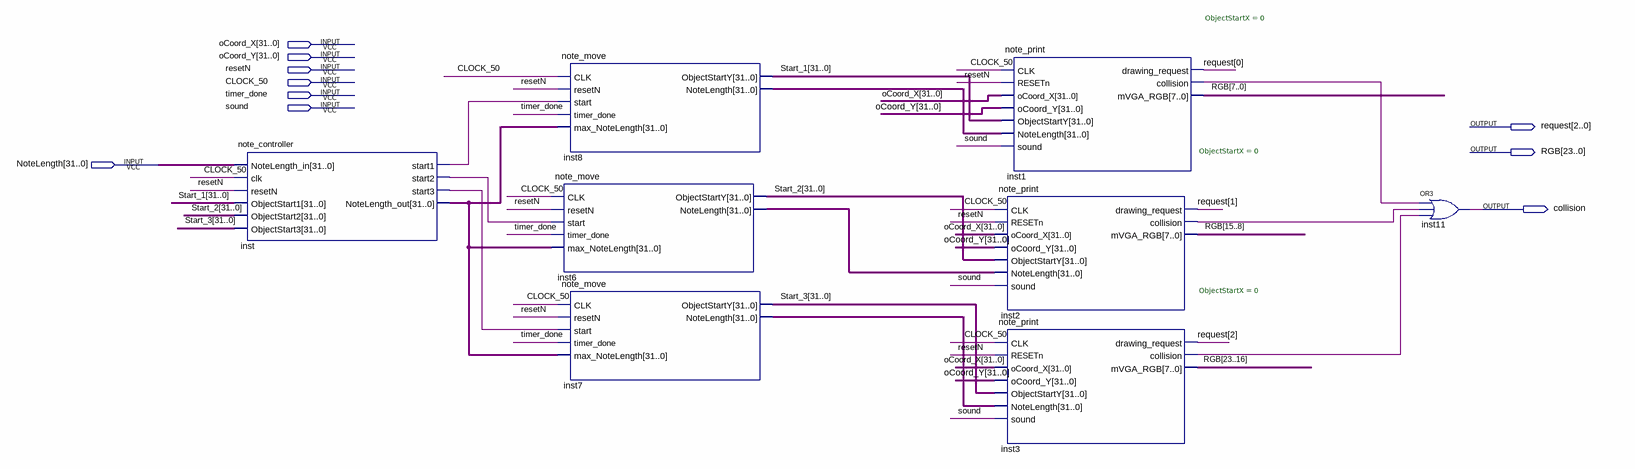
[diagram p0: schematic sheet]
// Quartus schematic note_module.bdf as structural Verilog: 8 symbols, 10 pins
module note_module (
  input  [31:0] oCoord_X,
  input  [31:0] oCoord_Y,
  input  resetN,
  input  CLOCK_50,
  input  timer_done,
  input  sound,
  input  [31:0] NoteLength,
  output [2:0] request,
  output [23:0] RGB,
  output collision
);

  wire inst1_collision, inst2_collision, inst3_collision, inst_start1, inst_start2, inst_start3;
  wire [31:0] inst6_notelength, inst7_notelength, inst8_notelength, inst_notelength_out, Start_1, Start_2,
       Start_3;

  note_controller inst (
    .NoteLength_in(NoteLength), .clk(CLOCK_50), .resetN(resetN), .ObjectStart1(Start_1),
    .ObjectStart2(Start_2), .ObjectStart3(Start_3), .start1(inst_start1), .start2(inst_start2),
    .start3(inst_start3), .NoteLength_out(inst_notelength_out));
  note_move inst6 (
    .CLK(CLOCK_50), .resetN(resetN), .start(inst_start2), .timer_done(timer_done),
    .max_NoteLength(inst_notelength_out), .ObjectStartY(Start_2), .NoteLength(inst6_notelength));
  note_move inst8 (
    .CLK(CLOCK_50), .resetN(resetN), .start(inst_start1), .timer_done(timer_done),
    .max_NoteLength(inst_notelength_out), .ObjectStartY(Start_1), .NoteLength(inst8_notelength));
  note_move inst7 (
    .CLK(CLOCK_50), .resetN(resetN), .start(inst_start3), .timer_done(timer_done),
    .max_NoteLength(inst_notelength_out), .ObjectStartY(Start_3), .NoteLength(inst7_notelength));
  note_print #(.ObjectStartX(0)) inst1 (
    .CLK(CLOCK_50), .RESETn(resetN), .oCoord_X(oCoord_X), .oCoord_Y(oCoord_Y), .ObjectStartY(Start_1),
    .NoteLength(inst8_notelength), .sound(sound), .drawing_request(request[0]), .collision(inst1_collision),
    .mVGA_RGB(RGB[7:0]));
  note_print #(.ObjectStartX(0)) inst2 (
    .CLK(CLOCK_50), .RESETn(resetN), .oCoord_X(oCoord_X), .oCoord_Y(oCoord_Y), .ObjectStartY(Start_2),
    .NoteLength(inst6_notelength), .sound(sound), .drawing_request(request[1]), .collision(inst2_collision),
    .mVGA_RGB(RGB[15:8]));
  note_print #(.ObjectStartX(0)) inst3 (
    .CLK(CLOCK_50), .RESETn(resetN), .oCoord_X(oCoord_X), .oCoord_Y(oCoord_Y), .ObjectStartY(Start_3),
    .NoteLength(inst7_notelength), .sound(sound), .drawing_request(request[2]), .collision(inst3_collision),
    .mVGA_RGB(RGB[23:16]));
  or inst11 (collision, inst1_collision, inst2_collision, inst3_collision);
endmodule
